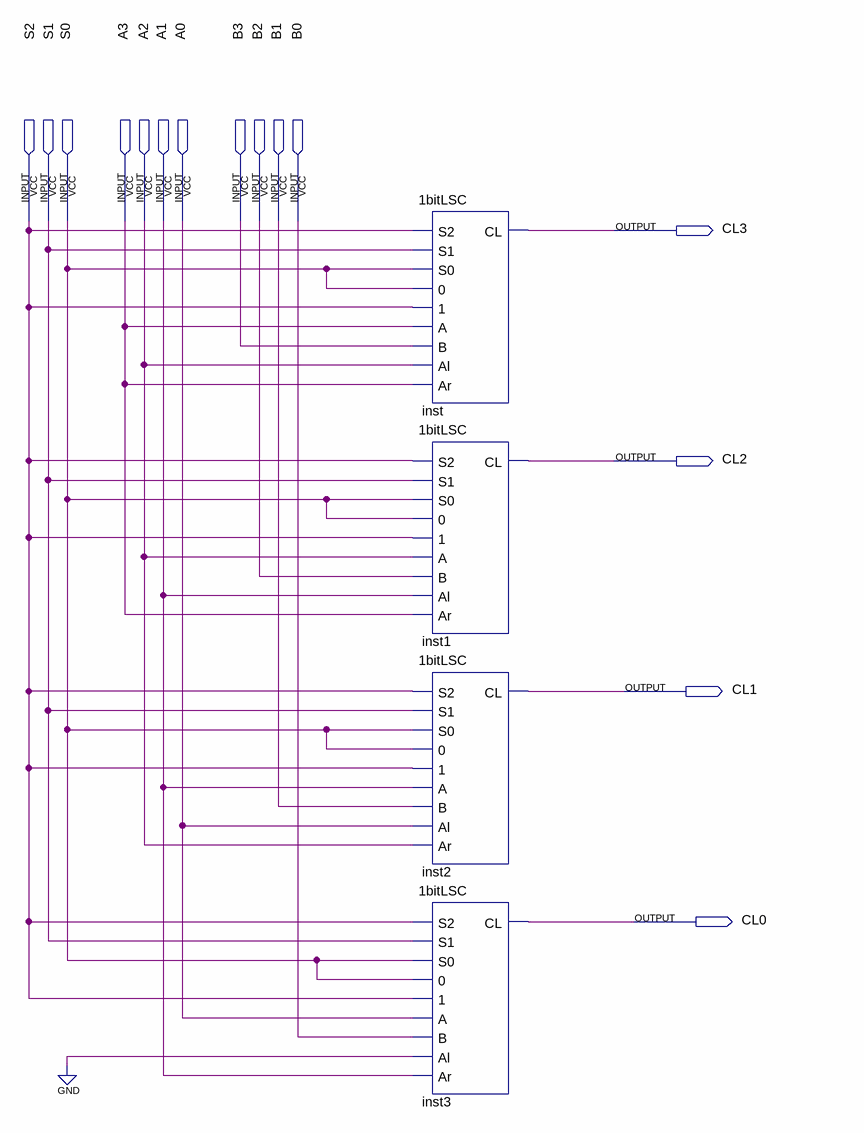
[diagram p0: schematic sheet]
// Quartus schematic logiccircuit4bit.bdf as structural Verilog: 4 symbols, 15 pins
module logiccircuit4bit (
  input  S2,
  input  S1,
  input  S0,
  input  A3,
  input  A2,
  input  A1,
  input  A0,
  input  B3,
  input  B2,
  input  B1,
  input  B0,
  output CL3,
  output CL2,
  output CL1,
  output CL0
);

  \1bitLSC  inst (.S2(S2), .S1(S1), .S0(S0), .\0 (S0), .\1 (S2), .A(A3), .B(B3), .Al(A2), .Ar(A3), .CL(CL3));
  \1bitLSC  inst1 (.S2(S2), .S1(S1), .S0(S0), .\0 (S0), .\1 (S2), .A(A2), .B(B2), .Al(A1), .Ar(A3), .CL(CL2));
  \1bitLSC  inst2 (.S2(S2), .S1(S1), .S0(S0), .\0 (S0), .\1 (S2), .A(A1), .B(B1), .Al(A0), .Ar(A2), .CL(CL1));
  \1bitLSC  inst3 (.S2(S2), .S1(S1), .S0(S0), .\0 (S0), .\1 (S2), .A(A0), .B(B0), .Al(1'b0), .Ar(A1), .CL(CL0));
endmodule
